# Altium schematic sheet MCU.SchDoc
size A
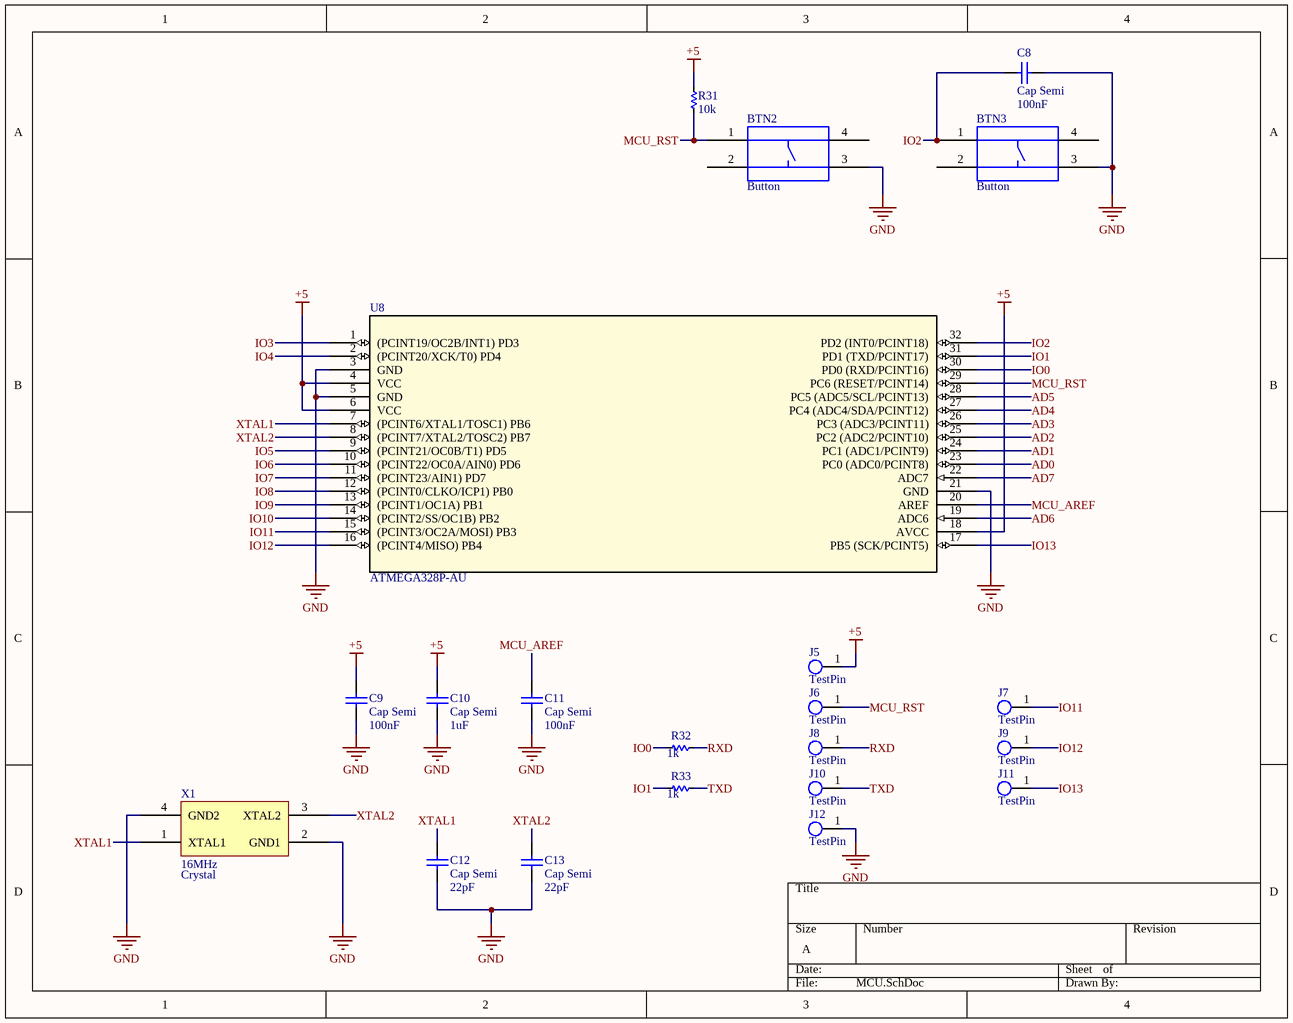
[diagram p0: MCU.SchDoc]

## Parts
BTN2  Button  [TactileButton_4x4]
BTN3  Button  [TactileButton_4x4]
C8  Cap Semi  value 100nF  [1608[0603]]
C9  Cap Semi  value 100nF  [1608[0603]]
C10  Cap Semi  value 1uF  [1608[0603]]
C11  Cap Semi  value 100nF  [1608[0603]]
C12  Cap Semi  value 22pF  [1608[0603]]
C13  Cap Semi  value 22pF  [1608[0603]]
J5  TestPin  [TestPin_1mm]
J6  TestPin  [TestPin_1mm]
J7  TestPin  [TestPin_1mm]
J8  TestPin  [TestPin_1mm]
J9  TestPin  [TestPin_1mm]
J10  TestPin  [TestPin_1mm]
J11  TestPin  [TestPin_1mm]
J12  TestPin  [TestPin_1mm]
R31  value 10k  [RES-SMD-0603]  (hidden comment: Res)
R32  value 1k  [RES-SMD-0603]  (hidden comment: Res)
R33  value 1k  [RES-SMD-0603]  (hidden comment: Res)
U8  ATMEGA328P-AU  [32A_ATM]
X1  Crystal  [SMD-3225-4P]

## Nets
+5: C9.2 C10.2 J5.1 R31.1 U8.4(VCC) U8.6(VCC) U8.18(AVCC)
GND: BTN2.3(Pin3) BTN3.3(Pin3) C8.1 C9.1 C10.1 C11.1 C12.1 C13.1 J12.1 U8.3(GND) U8.5(GND) U8.21(GND) X1.2(GND1) X1.4(GND2)
AD0: U8.23(PC0_(ADC0/PCINT8))
AD1: U8.24(PC1_(ADC1/PCINT9))
AD2: U8.25(PC2_(ADC2/PCINT10))
AD3: U8.26(PC3_(ADC3/PCINT11))
AD4: U8.27(PC4_(ADC4/SDA/PCINT12))
AD5: U8.28(PC5_(ADC5/SCL/PCINT13))
AD6: U8.19(ADC6)
AD7: U8.22(ADC7)
IO0: R32.2 U8.30(PD0_(RXD/PCINT16))
IO1: R33.2 U8.31(PD1_(TXD/PCINT17))
IO2: BTN3.1(Pin1) C8.2 U8.32(PD2_(INT0/PCINT18))
IO3: U8.1((PCINT19/OC2B/INT1)_PD3)
IO4: U8.2((PCINT20/XCK/T0)_PD4)
IO5: U8.9((PCINT21/OC0B/T1)_PD5)
IO6: U8.10((PCINT22/OC0A/AIN0)_PD6)
IO7: U8.11((PCINT23/AIN1)_PD7)
IO8: U8.12((PCINT0/CLKO/ICP1)_PB0)
IO9: U8.13((PCINT1/OC1A)_PB1)
IO10: U8.14((PCINT2/SS/OC1B)_PB2)
IO11: J7.1 U8.15((PCINT3/OC2A/MOSI)_PB3)
IO12: J9.1 U8.16((PCINT4/MISO)_PB4)
IO13: J11.1 U8.17(PB5_(SCK/PCINT5))
MCU_AREF: C11.2 U8.20(AREF)
MCU_RST: BTN2.1(Pin1) J6.1 R31.2 U8.29(PC6_(RESET/PCINT14))
RXD: J8.1 R32.1
TXD: J10.1 R33.1
XTAL1: C12.2 U8.7((PCINT6/XTAL1/TOSC1)_PB6) X1.1(XTAL1)
XTAL2: C13.2 U8.8((PCINT7/XTAL2/TOSC2)_PB7) X1.3(XTAL2)

Not connected (* = marked no-connect by the designer): BTN2 2(Pin2) 4(Pin4); BTN3 2(Pin2) 4(Pin4)

## Library data of the parts
BTN2 BTN3 = Tactile_4x4
C8-C13 = Cap Semi: Capacitor (Semiconductor SIM Model); Published: 8-Jun-2000; LatestRevisionDate: 29-May-2009; LatestRevisionNote: IPC-7351 Footprint Added.; PackageReference: C1206; Publisher: Altium Limited; PackageDescription: Chip Capacitor
J5-J12 = TestPin_1mm: Test conntact for pogo pins
R31-R33 = Res-SMD: Resistor; Manufacturer: Generic Components; Class: Passive; Published: 08/06/2000; Publisher: Altium Hobart Technology Centre
U8 = ATMEGA328P-AU: No Description Available; Built_By: EMA_UL_Team; Vendor: Atmel; SourceLibrary: Atmel_2011-04-02; Manufacturer_Part_Number: ATMEGA328P-AU; Copyright: Copyright (C) 2018 Accelerated Designs. All rights reserved; RefDes: RefDes; Type: DEV
X1 = Crystal 3225: 16MHz ±25ppm SMD3225-4P Oscillators ROHS; Value: 16MHz